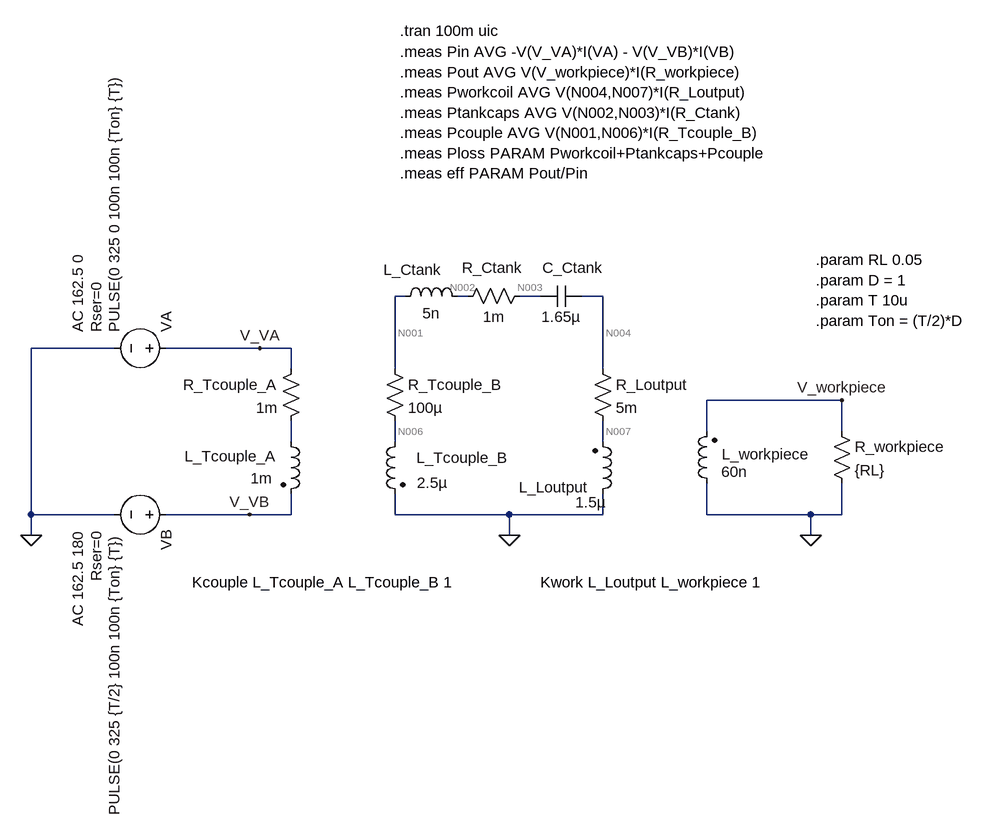
[diagram p0: schematic work_coil_circuit.asc]
work_coil_circuit.asc, the LTspice schematic file:
Version 4
SHEET 1 880 1032
WIRE -176 -96 -192 -96
WIRE -80 -96 -96 -96
WIRE 32 -96 0 -96
WIRE 128 -96 96 -96
WIRE -624 -16 -752 -16
WIRE -400 -16 -544 -16
WIRE -352 -16 -400 -16
WIRE -352 16 -352 -16
WIRE -192 16 -192 -96
WIRE 128 16 128 -96
WIRE 496 64 288 64
WIRE 288 112 288 64
WIRE 496 112 496 64
WIRE -352 128 -352 96
WIRE -192 128 -192 96
WIRE 128 128 128 96
WIRE -752 240 -752 -16
WIRE -624 240 -752 240
WIRE -416 240 -544 240
WIRE -352 240 -352 208
WIRE -352 240 -416 240
WIRE -192 240 -192 208
WIRE -16 240 -192 240
WIRE 128 240 128 208
WIRE 128 240 -16 240
WIRE 288 240 288 192
WIRE 448 240 288 240
WIRE 496 240 496 192
WIRE 496 240 448 240
WIRE -752 272 -752 240
WIRE -16 272 -16 240
WIRE 448 272 448 240
FLAG -16 272 0
FLAG 448 272 0
FLAG -752 272 0
FLAG 496 64 V_workpiece
FLAG -400 -16 V_VA
FLAG -416 240 V_VB
SYMBOL ind2 112 224 M180
WINDOW 0 -5 26 Right 2
WINDOW 3 -26 3 Left 2
SYMATTR InstName L_Loutput
SYMATTR Value 1.5µ
SYMATTR Type ind
SYMATTR SpiceLine Rser=0
SYMBOL ind2 304 208 R180
WINDOW 0 -7 61 Right 2
WINDOW 3 -47 34 Left 2
SYMATTR InstName L_workpiece
SYMATTR Value 60n
SYMATTR Type ind
SYMATTR SpiceLine Rser=0
SYMBOL voltage -528 -16 M270
WINDOW 123 24 152 Left 2
WINDOW 39 24 124 Left 2
SYMATTR Value2 AC 162.5 0
SYMATTR SpiceLine Rser=0
SYMATTR InstName VA
SYMATTR Value PULSE(0 325 0 100n 100n {Ton} {T})
SYMBOL cap 32 -80 R270
WINDOW 0 44 50 VTop 2
WINDOW 3 0 32 VBottom 2
SYMATTR InstName C_Ctank
SYMATTR Value 1.65µ
SYMATTR SpiceLine Rser=0 Lser=0 Cpar=0
SYMBOL res -96 -80 R270
WINDOW 0 44 54 VTop 2
WINDOW 3 0 56 VBottom 2
SYMATTR InstName R_Ctank
SYMATTR Value 1m
SYMBOL res 112 0 R0
SYMATTR InstName R_Loutput
SYMATTR Value 5m
SYMBOL ind2 -368 112 R0
WINDOW 0 -5 38 Right 2
WINDOW 3 -46 72 Left 2
SYMATTR InstName L_Tcouple_A
SYMATTR Value 1m
SYMATTR Type ind
SYMATTR SpiceLine Rser=0
SYMBOL ind2 -176 112 M0
WINDOW 0 -17 41 Right 2
WINDOW 3 -65 79 Left 2
SYMATTR InstName L_Tcouple_B
SYMATTR Value 2.5µ
SYMATTR Type ind
SYMATTR SpiceLine Rser=0
SYMBOL res -336 0 M0
SYMATTR InstName R_Tcouple_A
SYMATTR Value 1m
SYMBOL res -208 0 R0
SYMATTR InstName R_Tcouple_B
SYMATTR Value 100µ
SYMBOL res 480 96 R0
SYMATTR InstName R_workpiece
SYMATTR Value {RL}
SYMBOL ind -192 -80 R270
WINDOW 0 41 27 VTop 2
WINDOW 3 5 56 VBottom 2
SYMATTR InstName L_Ctank
SYMATTR Value 5n
SYMATTR SpiceLine Rser=0
SYMBOL voltage -528 240 R90
WINDOW 123 24 152 Left 2
WINDOW 39 24 124 Left 2
SYMATTR Value2 AC 162.5 180
SYMATTR SpiceLine Rser=0
SYMATTR InstName VB
SYMATTR Value PULSE(0 325 {T/2} 100n 100n {Ton} {T})
TEXT 32 344 Left 2 !Kwork L_Loutput L_workpiece 1
TEXT -184 -504 Left 2 !.tran 100m uic
TEXT -504 344 Left 2 !Kcouple L_Tcouple_A L_Tcouple_B 1
TEXT -184 -472 Left 2 !.meas Pin AVG -V(V_VA)*I(VA) - V(V_VB)*I(VB)\n.meas Pout AVG V(V_workpiece)*I(R_workpiece)\n.meas Pworkcoil AVG V(N004,N007)*I(R_Loutput)\n.meas Ptankcaps AVG V(N002,N003)*I(R_Ctank)\n.meas Pcouple AVG V(N001,N006)*I(R_Tcouple_B)\n.meas Ploss PARAM Pworkcoil+Ptankcaps+Pcouple\n.meas eff PARAM Pout/Pin
TEXT 456 -152 Left 2 !.param RL 0.05\n.param D = 1\n.param T 10u\n.param Ton = (T/2)*D

The netlist it stands for:
* work_coil_circuit.asc
L_Loutput 0 N007 1.5µ Rser=0
L_workpiece 0 V_workpiece 60n Rser=0
VA V_VA 0 PULSE(0 325 0 100n 100n {Ton} {T}) AC 162.5 0 Rser=0
C_Ctank N003 N004 1.65µ Rser=0 Lser=0 Cpar=0
R_Ctank N002 N003 1m
R_Loutput N004 N007 5m
L_Tcouple_A N005 V_VB 1m Rser=0
L_Tcouple_B N006 0 2.5µ Rser=0
R_Tcouple_A V_VA N005 1m
R_Tcouple_B N001 N006 100µ
R_workpiece V_workpiece 0 {RL}
L_Ctank N001 N002 5n Rser=0
VB V_VB 0 PULSE(0 325 {T/2} 100n 100n {Ton} {T}) AC 162.5 180 Rser=0
Kwork L_Loutput L_workpiece 1
.tran 100m uic
Kcouple L_Tcouple_A L_Tcouple_B 1
.meas Pin AVG -V(V_VA)*I(VA) - V(V_VB)*I(VB)
.meas Pout AVG V(V_workpiece)*I(R_workpiece)
.meas Pworkcoil AVG V(N004,N007)*I(R_Loutput)
.meas Ptankcaps AVG V(N002,N003)*I(R_Ctank)
.meas Pcouple AVG V(N001,N006)*I(R_Tcouple_B)
.meas Ploss PARAM Pworkcoil+Ptankcaps+Pcouple
.meas eff PARAM Pout/Pin
.param RL 0.05
.param D = 1
.param T 10u
.param Ton = (T/2)*D
.backanno
.end